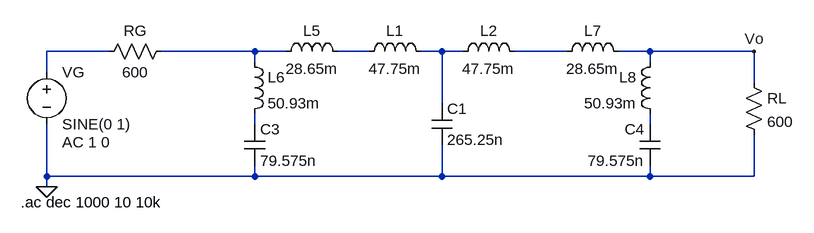
[diagram p0: schematic ej9.asc]
ej9.asc, the LTspice schematic file:
Version 4
SHEET 1 1220 776
WIRE 160 112 64 112
WIRE 384 112 240 112
WIRE 432 112 384 112
WIRE 560 112 512 112
WIRE 672 112 640 112
WIRE 704 112 672 112
WIRE 864 112 784 112
WIRE 992 112 944 112
WIRE 1152 112 992 112
WIRE 384 128 384 112
WIRE 992 128 992 112
WIRE 64 144 64 112
WIRE 1152 160 1152 112
WIRE 672 192 672 112
WIRE 384 224 384 208
WIRE 992 224 992 208
WIRE 64 304 64 224
WIRE 384 304 384 288
WIRE 384 304 64 304
WIRE 672 304 672 256
WIRE 672 304 384 304
WIRE 992 304 992 288
WIRE 992 304 672 304
WIRE 1152 304 1152 240
WIRE 1152 304 992 304
WIRE 64 320 64 304
FLAG 64 320 0
FLAG 1152 112 Vo
SYMBOL voltage 64 128 R0
WINDOW 123 24 124 Left 2
WINDOW 39 0 0 Left 0
SYMATTR Value2 AC 1 0
SYMATTR InstName VG
SYMATTR Value SINE(0 1)
SYMBOL res 144 128 R270
WINDOW 0 32 56 VTop 2
WINDOW 3 0 56 VBottom 2
SYMATTR InstName RG
SYMATTR Value 600
SYMBOL ind 544 128 R270
WINDOW 0 32 56 VTop 2
WINDOW 3 5 56 VBottom 2
SYMATTR InstName L1
SYMATTR Value 47.75m
SYMBOL ind 688 128 R270
WINDOW 0 32 56 VTop 2
WINDOW 3 5 56 VBottom 2
SYMATTR InstName L2
SYMATTR Value 47.75m
SYMBOL cap 656 192 R0
SYMATTR InstName C1
SYMATTR Value 265.25n
SYMBOL res 1136 144 R0
SYMATTR InstName RL
SYMATTR Value 600
SYMBOL ind 416 128 R270
WINDOW 0 32 56 VTop 2
WINDOW 3 5 56 VBottom 2
SYMATTR InstName L5
SYMATTR Value 28.65m
SYMBOL ind 368 112 R0
SYMATTR InstName L6
SYMATTR Value 50.93m
SYMBOL cap 368 224 R0
SYMATTR InstName C3
SYMATTR Value 79.575n
SYMBOL ind 960 128 M270
WINDOW 0 32 56 VTop 2
WINDOW 3 5 56 VBottom 2
SYMATTR InstName L7
SYMATTR Value 28.65m
SYMBOL ind 1008 112 M0
SYMATTR InstName L8
SYMATTR Value 50.93m
SYMBOL cap 1008 224 M0
SYMATTR InstName C4
SYMATTR Value 79.575n
TEXT 24 344 Left 2 !.ac dec 1000 10 10k

The netlist it stands for:
* ej9.asc
VG N001 0 SINE(0 1) AC 1 0
RG N001 N002 600
L1 N003 N004 47.75m
L2 N004 N005 47.75m
C1 N004 0 265.25n
RL Vo 0 600
L5 N002 N003 28.65m
L6 N002 N006 50.93m
C3 N006 0 79.575n
L7 Vo N005 28.65m
L8 Vo N007 50.93m
C4 N007 0 79.575n
.ac dec 1000 10 10k
.backanno
.end